# EAGLE schematic multisonar (EAGLE 8.2.2)
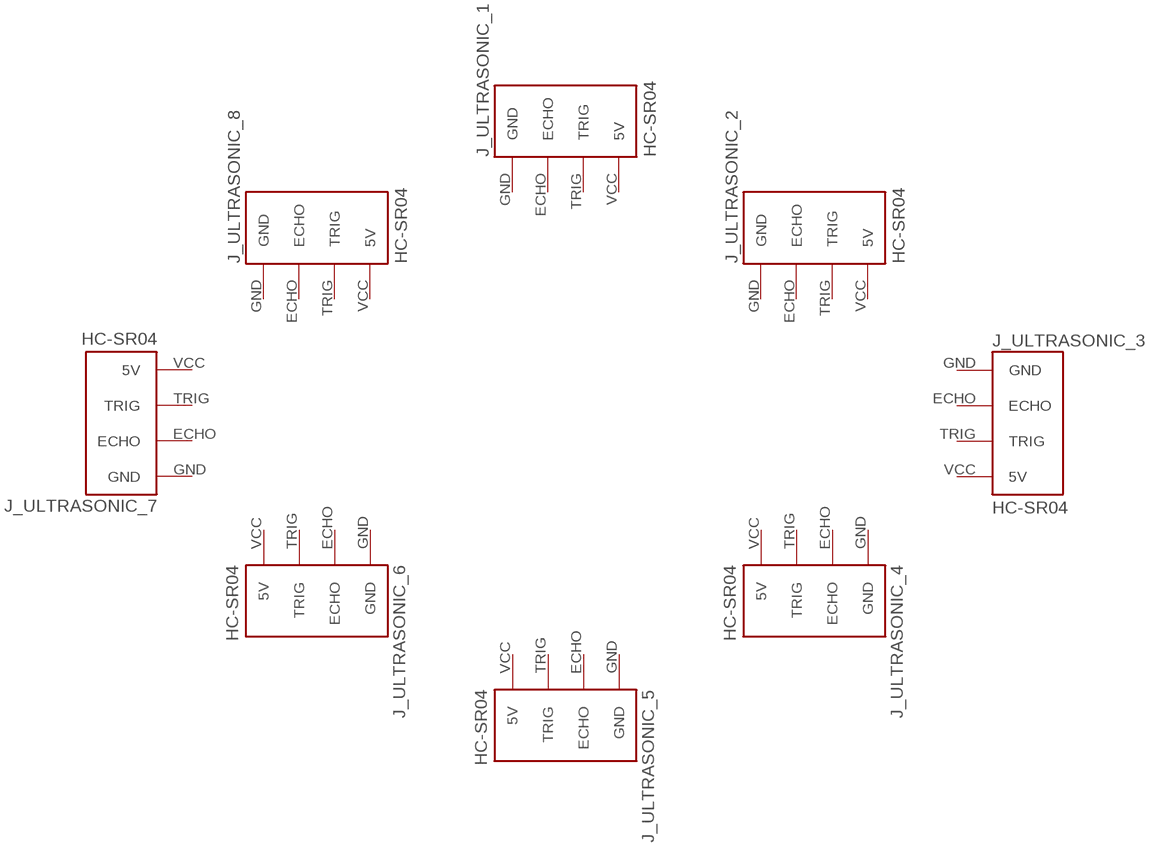
[diagram p0: schematic, sheet 1]

## Parts
J_ULTRASONIC_1  HC-SR04  [HC-SR04_FOOTPRINT]
J_ULTRASONIC_2  HC-SR04  [HC-SR04_FOOTPRINT]
J_ULTRASONIC_3  HC-SR04  [HC-SR04_FOOTPRINT]
J_ULTRASONIC_4  HC-SR04  [HC-SR04_FOOTPRINT]
J_ULTRASONIC_5  HC-SR04  [HC-SR04_FOOTPRINT]
J_ULTRASONIC_6  HC-SR04  [HC-SR04_FOOTPRINT]
J_ULTRASONIC_7  HC-SR04  [HC-SR04_FOOTPRINT]
J_ULTRASONIC_8  HC-SR04  [HC-SR04_FOOTPRINT]
Unconnected: J_ULTRASONIC_1.ECHO J_ULTRASONIC_1.GND J_ULTRASONIC_1.TRIG J_ULTRASONIC_1.VCC(5V) J_ULTRASONIC_2.ECHO J_ULTRASONIC_2.GND J_ULTRASONIC_2.TRIG J_ULTRASONIC_2.VCC(5V) J_ULTRASONIC_3.ECHO J_ULTRASONIC_3.GND J_ULTRASONIC_3.TRIG J_ULTRASONIC_3.VCC(5V) J_ULTRASONIC_4.ECHO J_ULTRASONIC_4.GND J_ULTRASONIC_4.TRIG J_ULTRASONIC_4.VCC(5V) J_ULTRASONIC_5.ECHO J_ULTRASONIC_5.GND J_ULTRASONIC_5.TRIG J_ULTRASONIC_5.VCC(5V) J_ULTRASONIC_6.ECHO J_ULTRASONIC_6.GND J_ULTRASONIC_6.TRIG J_ULTRASONIC_6.VCC(5V) J_ULTRASONIC_7.ECHO J_ULTRASONIC_7.GND J_ULTRASONIC_7.TRIG J_ULTRASONIC_7.VCC(5V) J_ULTRASONIC_8.ECHO J_ULTRASONIC_8.GND J_ULTRASONIC_8.TRIG J_ULTRASONIC_8.VCC(5V)

## Library data of the parts
J_ULTRASONIC_1-J_ULTRASONIC_8 = Ultrasonic Sensor HC-SR04:HC-SR04: Ultrasonic Sensor HC-SR04